# EAGLE schematic e-Tapperhandpiece19 (EAGLE 8.4.0)
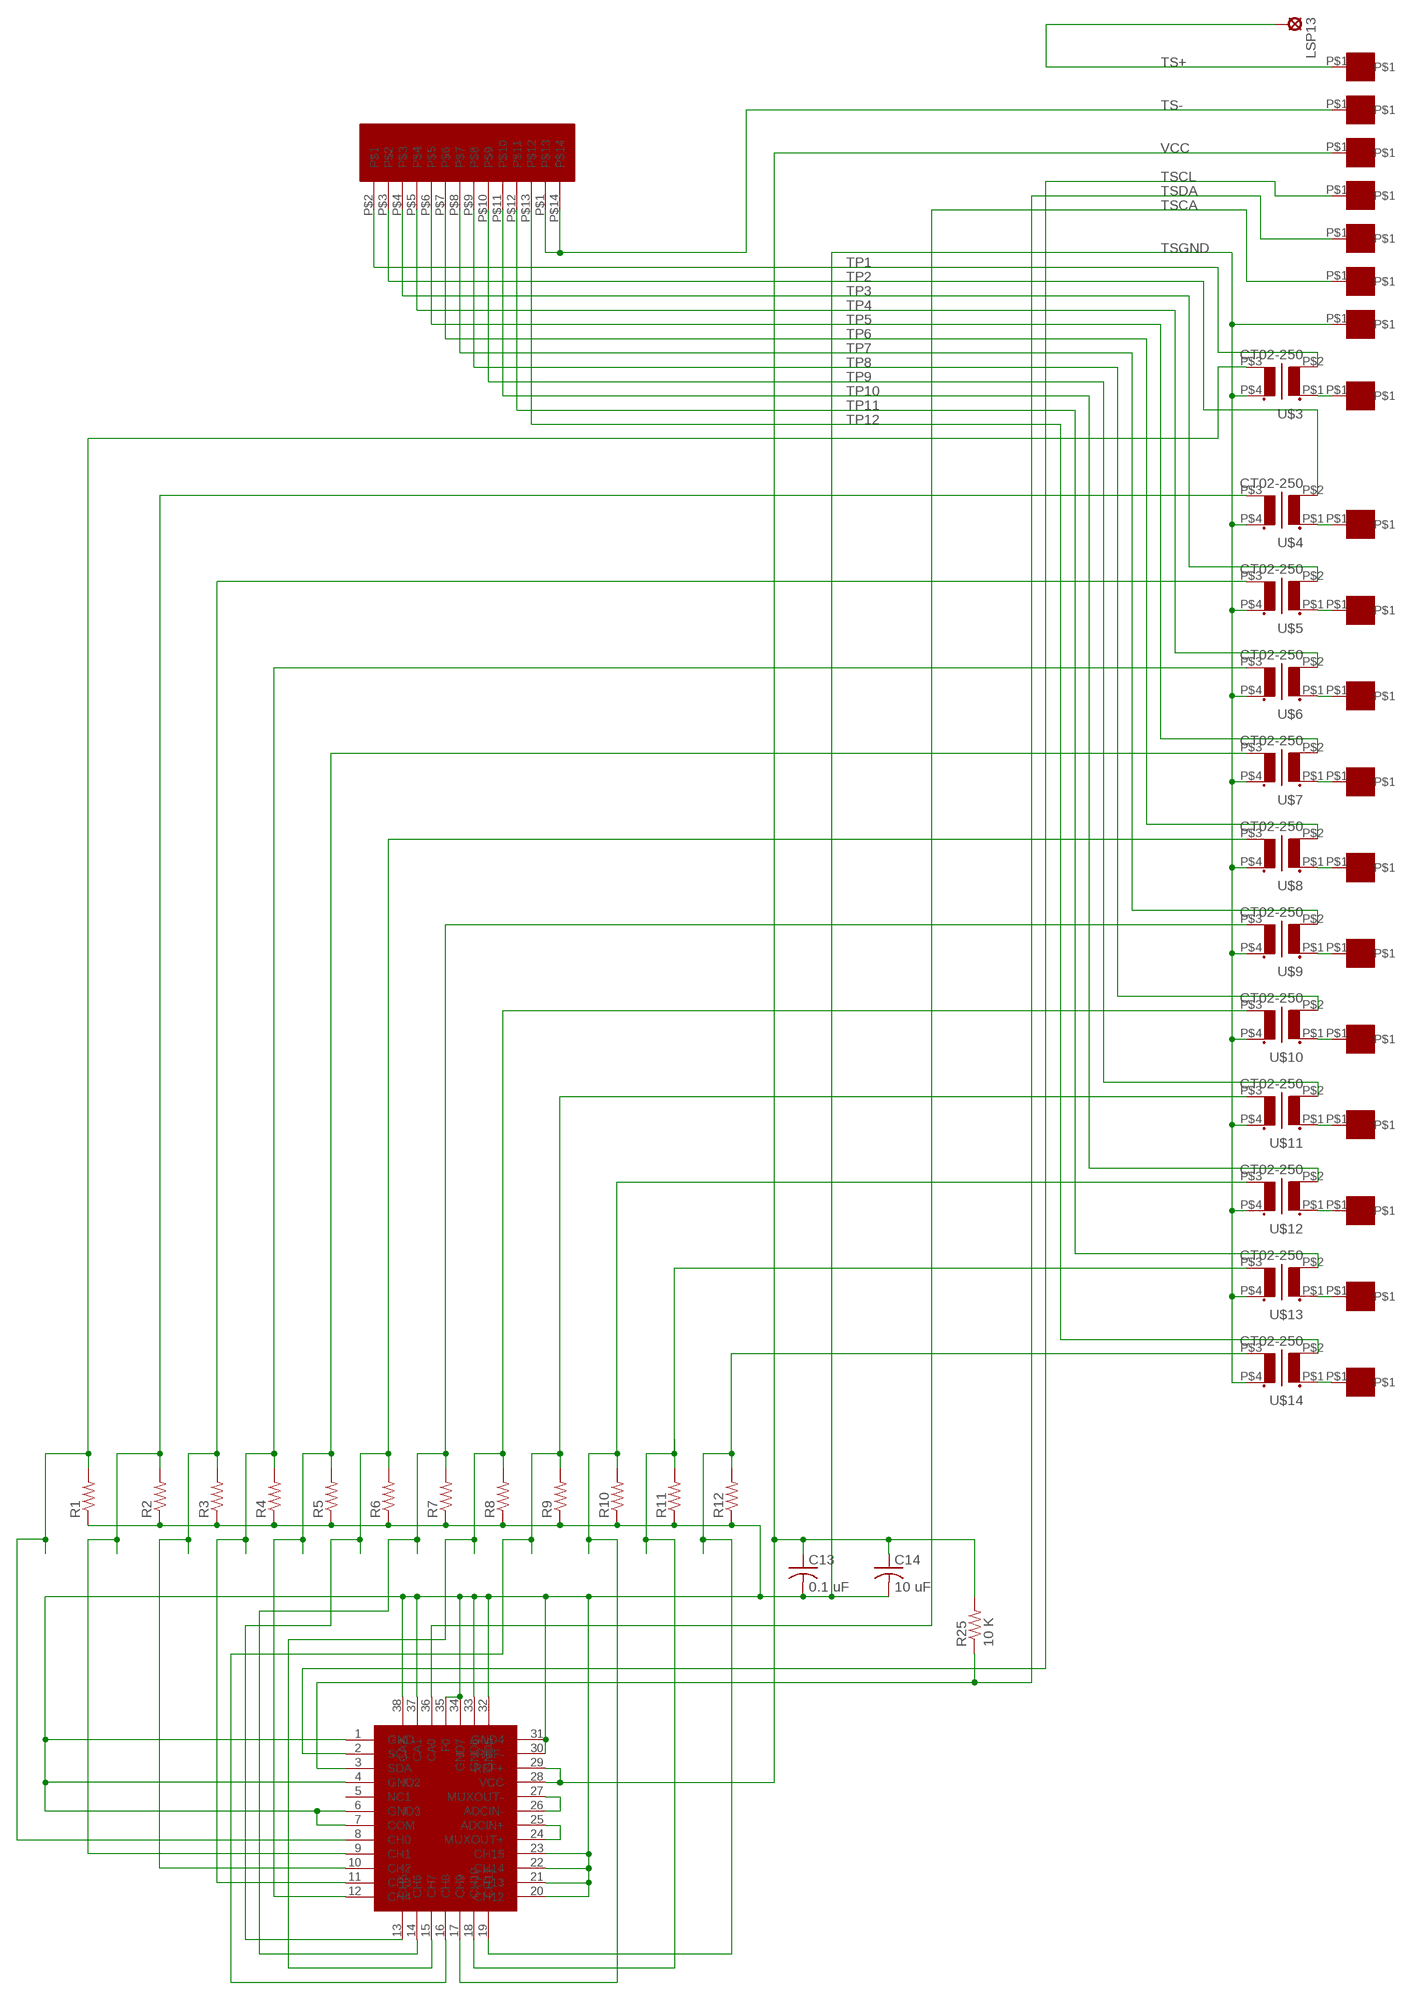
[diagram p0: schematic, sheet 1]

## Parts
C13  0.1 uF  C-USC0603  [C0603]
C14  10 uF  C-USC0805  [C0805]
LSP13  SE11  [SE11]
R1  R-US_R0402  [R0402]
R2  R-US_R0402  [R0402]
R3  R-US_R0402  [R0402]
R4  R-US_R0402  [R0402]
R5  R-US_R0402  [R0402]
R6  R-US_R0402  [R0402]
R7  R-US_R0402  [R0402]
R8  R-US_R0402  [R0402]
R9  R-US_R0402  [R0402]
R10  R-US_R0402  [R0402]
R11  R-US_R0402  [R0402]
R12  R-US_R0402  [R0402]
R25  10 K  R-US_R0402  [R0402]
TSP1  ET1  [ET1]
TSP2  ET1  [ET1]
TSP3  ET1  [ET1]
TSP4  ET1  [ET1]
TSP5  ET1  [ET1]
TSP6  ET1  [ET1]
TSP7  ET1  [ET1]
TSP8  ET1  [ET1]
TSP9  ET1  [ET1]
TSP10  ET1  [ET1]
TSP11  ET1  [ET1]
TSP12  ET1  [ET1]
TSP13  ET1  [ET1]
TSP14  ET1  [ET1]
TSP15  ET1  [ET1]
TSP16  ET1  [ET1]
TSP17  ET1  [ET1]
TSP18  ET1  [ET1]
TSP19  ET1  [ET1]
U$1  LTC2497  [QFN38-5X7]
U$2  SS112D01  [SS112D01]
U$3  CT02-250  [CT02-250]
U$4  CT02-250  [CT02-250]
U$5  CT02-250  [CT02-250]
U$6  CT02-250  [CT02-250]
U$7  CT02-250  [CT02-250]
U$8  CT02-250  [CT02-250]
U$9  CT02-250  [CT02-250]
U$10  CT02-250  [CT02-250]
U$11  CT02-250  [CT02-250]
U$12  CT02-250  [CT02-250]
U$13  CT02-250  [CT02-250]
U$14  CT02-250  [CT02-250]

## Nets
N$1: R9.2 U$1.16(CH8) U$11.P$3(S2)
N$2: U$1.26(ADCIN-) U$1.27(MUXOUT-)
N$3: U$1.24(MUXOUT+) U$1.25(ADCIN+)
N$4: TSP1.P$1 U$3.P$1(P1)
N$5: R12.2 U$1.19(CH11) U$14.P$3(S2)
N$6: TSP2.P$1 U$4.P$1(P1)
N$7: R4.2 U$1.11(CH3) U$6.P$3(S2)
N$8: R10.2 U$1.17(CH9) U$12.P$3(S2)
N$9: R8.2 U$1.15(CH7) U$10.P$3(S2)
N$10: TSP3.P$1 U$5.P$1(P1)
N$11: TSP4.P$1 U$6.P$1(P1)
N$12: TSP5.P$1 U$7.P$1(P1)
N$13: TSP6.P$1 U$8.P$1(P1)
N$14: TSP7.P$1 U$9.P$1(P1)
N$15: TSP8.P$1 U$10.P$1(P1)
N$16: TSP9.P$1 U$11.P$1(P1)
N$17: TSP10.P$1 U$12.P$1(P1)
N$18: R5.2 U$1.12(CH4) U$7.P$3(S2)
N$19: R6.2 U$1.13(CH5) U$8.P$3(S2)
N$20: R7.2 U$1.14(CH6) U$9.P$3(S2)
N$21: TSP11.P$1 U$13.P$1(P1)
N$22: R3.2 U$1.10(CH2) U$5.P$3(S2)
N$23: R2.2 U$1.9(CH1) U$4.P$3(S2)
N$24: R11.2 U$1.18(CH10) U$13.P$3(S2)
N$25: R1.2 U$1.8(CH0) U$3.P$3(S2)
N$26: TSP12.P$1 U$14.P$1(P1)
TP1: U$2.P$2 U$3.P$2(P2)
TP2: U$2.P$3 U$4.P$2(P2)
TP3: U$2.P$4 U$5.P$2(P2)
TP4: U$2.P$5 U$6.P$2(P2)
TP5: U$2.P$6 U$7.P$2(P2)
TP6: U$2.P$7 U$8.P$2(P2)
TP7: U$2.P$8 U$9.P$2(P2)
TP8: U$2.P$9 U$10.P$2(P2)
TP9: U$2.P$10 U$11.P$2(P2)
TP10: U$2.P$11 U$12.P$2(P2)
TP11: U$2.P$12 U$13.P$2(P2)
TP12: U$2.P$13 U$14.P$2(P2)
TS+: LSP13.MP TSP13.P$1
TS-: TSP14.P$1 U$2.P$1 U$2.P$14
TSCA: TSP18.P$1 U$1.36(CA0)
TSCL: TSP16.P$1 U$1.2(SCL)
TSDA: R25.1 TSP17.P$1 U$1.3(SDA)
TSGND: C13.2 C14.2 R1.1 R2.1 R3.1 R4.1 R5.1 R6.1 R7.1 R8.1 R9.1 R10.1 R11.1 R12.1 TSP19.P$1 U$1.1(GND) U$1.4(GND2) U$1.6(GND3) U$1.7(COM) U$1.20(CH12) U$1.21(CH13) U$1.22(CH14) U$1.23(CH15) U$1.30(REF-) U$1.31(GND4) U$1.32(GND5) U$1.33(GND6) U$1.34(GND7) U$1.35(F0) U$1.37(CA1) U$1.38(CA2) U$3.P$4(S1) U$4.P$4(S1) U$5.P$4(S1) U$6.P$4(S1) U$7.P$4(S1) U$8.P$4(S1) U$9.P$4(S1) U$10.P$4(S1) U$11.P$4(S1) U$12.P$4(S1) U$13.P$4(S1) U$14.P$4(S1)
VCC: C13.1 C14.1 R25.2 TSP15.P$1 U$1.28(VCC) U$1.29(REF+)
Unconnected: U$1.5(NC1)

## Library data of the parts
C13 C14 = rcl:C-US: CAPACITOR, American symbol
LSP13 = solpad:SE11: SOLDER PAD RTM, drill 1,1mm, distributor Buerklin, 07F810
R1-R12 R25 = resistor:R-US_: RESISTOR, American symbol
TSP1-TSP19 = ET1:ET1: Through Hold Pads 20 mil drill hole
U$1 = LTC2497:LTC2497: LTC2497 16 Channel ADC with I2C interface
U$2 = SS112D01:SS112D01
U$3-U$14 = CT02-250:CT02-250: Current Transformer ICE Components 1:250 turns ratio

## Net classes
0 default: clearance 0.205 mm